# EAGLE design Wi-Fi_Button_v1 (EAGLE 8.7.1)

## Sheet 1 of 2
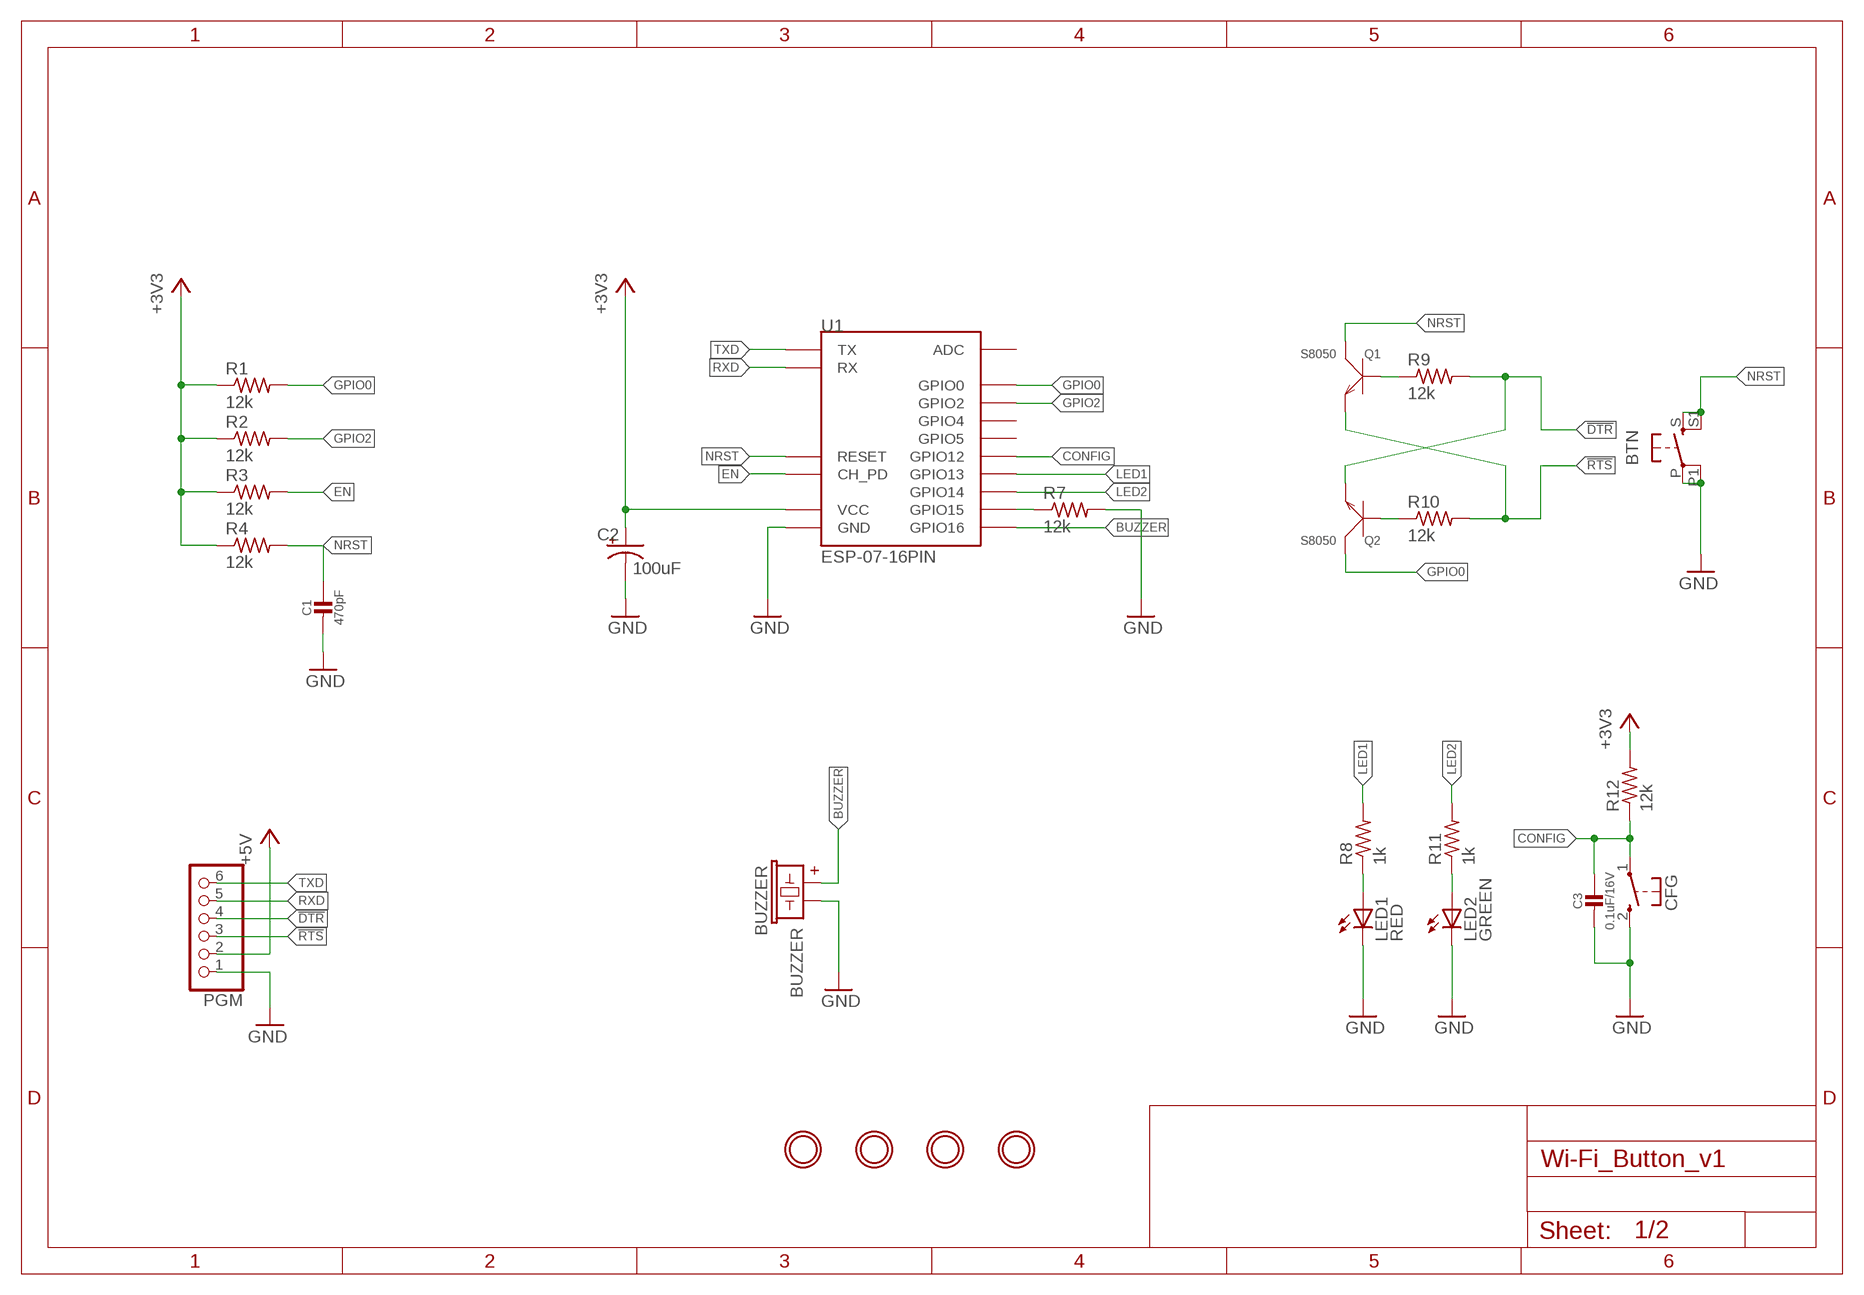
[diagram p0: schematic, sheet 1]

### Parts
$H1  MOUNTINGHOLE2.5  [MOUNTINGHOLE_2.5_PLATED]
$H2  MOUNTINGHOLE2.5  [MOUNTINGHOLE_2.5_PLATED]
$H3  MOUNTINGHOLE2.5  [MOUNTINGHOLE_2.5_PLATED]
$H4  MOUNTINGHOLE2.5  [MOUNTINGHOLE_2.5_PLATED]
BTN  SWITRONIC_12XXS  [SWITRONIC_12X12]
BUZZER  BUZZER  [BUUZER-HN9605B]
C1  470pF  CAP_CERAMIC_0805  [_0805]
C2  100uF  CPOL-USA/3216-18R  [A/3216-18R]
C3  0.1uF/16V  CAP_CERAMIC_0805  [_0805]
CFG  KSS-2EG4430  [KSS-2EG4430]
LED1  RED  LEDCHIP-LED0805  [CHIP-LED0805]
LED2  GREEN  LEDCHIP-LED0805  [CHIP-LED0805]
PGM  PINHD-1X6  [1X06]
Q1  S8050  SMD-TRANSISTORS-NPN-25V-500MW(SOT-23)  [SOT-23]
Q2  S8050  SMD-TRANSISTORS-NPN-25V-500MW(SOT-23)  [SOT-23]
R1  12k  R-US_M0805  [M0805]
R2  12k  R-US_M0805  [M0805]
R3  12k  R-US_M0805  [M0805]
R4  12k  R-US_M0805  [M0805]
R7  12k  R-US_M0805  [M0805]
R8  1k  R-US_M0805  [M0805]
R9  12k  R-US_M0805  [M0805]
R10  12k  R-US_M0805  [M0805]
R11  1k  R-US_M0805  [M0805]
R12  12k  R-US_M0805  [M0805]
U1  ESP-07-16PIN  [ESP-07-16PIN]

### Nets
!DTR: PGM.4 Q2.2(E) R9.2
!RTS: PGM.3 Q1.2(E) R10.2
+3V3: C2.+ R1.1 R2.1 R3.1 R4.1 R12.2 U1.VCC ; also sheet 2
+5V [usbvcc]: PGM.2 ; also sheet 2
BUZZER: BUZZER.1 U1.GPIO16
CONFIG: C3.1 CFG.1(P) R12.1 U1.GPIO12
EN: R3.2 U1.CH_PD
GND: BTN.P BTN.P1 BUZZER.2 C1.2 C2.- C3.2 CFG.2(S) LED1.C LED2.C PGM.1 R7.2 U1.GND ; also sheet 2
GPIO0: Q2.3(C) R1.2 U1.GPIO0
GPIO2: R2.2 U1.GPIO2
LED1: R8.2 U1.GPIO13
LED2: R11.2 U1.GPIO14
N$1: Q1.1(B) R9.1
N$2: Q2.1(B) R10.1
N$3: R7.1 U1.GPIO15
N$10: LED1.A R8.1
N$12: LED2.A R11.1
NRST: BTN.S BTN.S1 C1.1 Q1.3(C) R4.2 U1.REST(RESET)
RXD: PGM.5 U1.RX
TXD: PGM.6 U1.TX
Unconnected: U1.ADC U1.GPIO4 U1.GPIO5

## Sheet 2 of 2
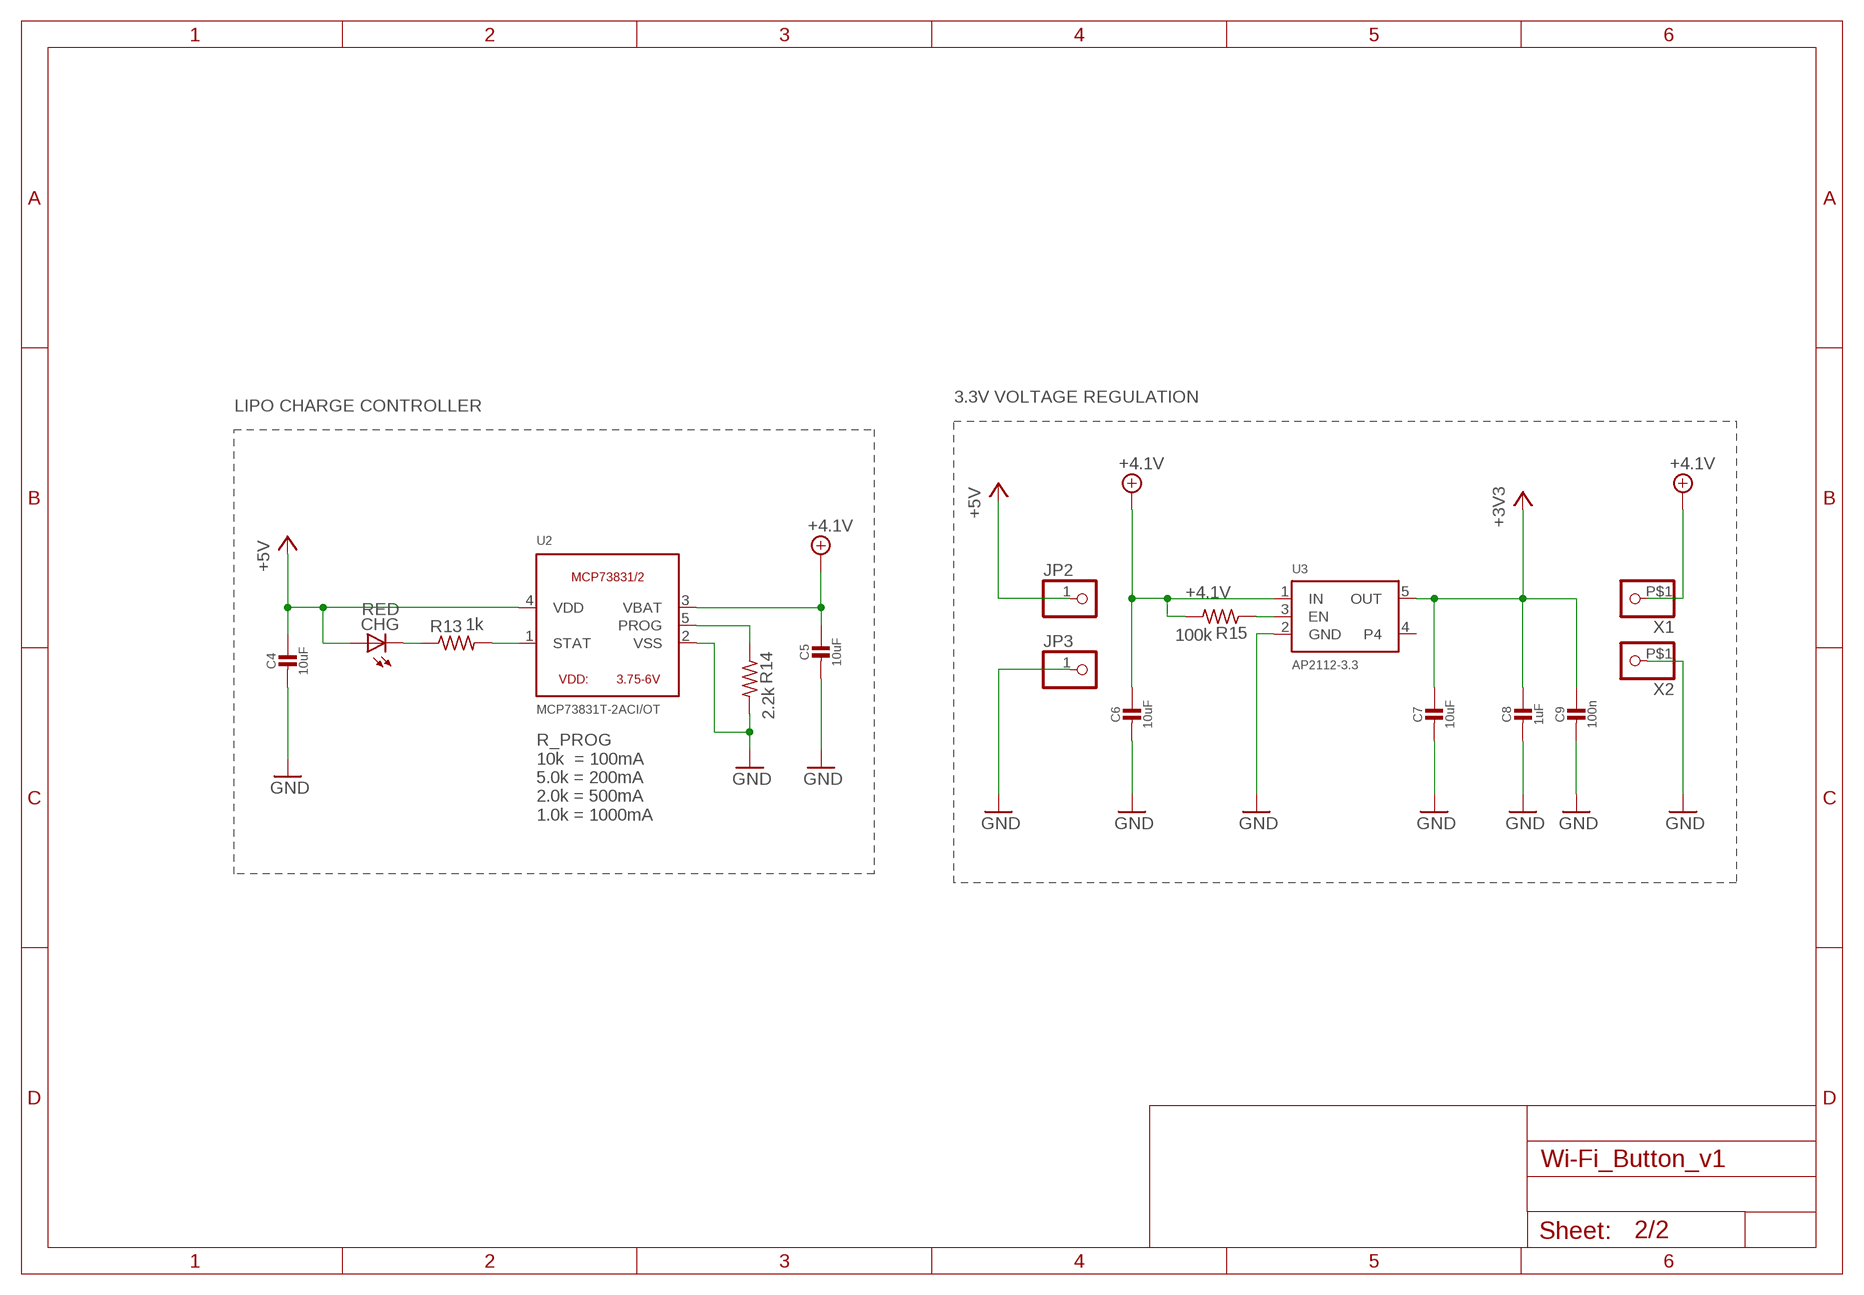
[diagram p1: schematic, sheet 2]

### Parts
C4  10uF  CAP_CERAMIC_0805  [_0805]
C5  10uF  CAP_CERAMIC_0805  [_0805]
C6  10uF  CAP_CERAMIC_0805  [_0805]
C7  10uF  CAP_CERAMIC_0805  [_0805]
C8  1uF  CAP_CERAMIC_0805  [_0805]
C9  100n  CAP_CERAMIC_0805  [_0805]
CHG  RED  LEDCHIP-LED0805  [CHIP-LED0805]
JP2  HEADER-1X1-SMD_MASKHELD_2X2MM  [1X01_SMD_MASKHELD_2X2MM]
JP3  HEADER-1X1-SMD_MASKHELD_2X2MM  [1X01_SMD_MASKHELD_2X2MM]
R13  1k  R-US_M0805  [M0805]
R14  2.2k  R-US_M0805  [M0805]
R15  100k  R-US_M0805  [M0805]
U2  MCP73831T-2ACI/OT  MCP73831/2  [SOT23-5]
U3  AP2112-3.3  VREG_SOT23-5  [SOT23-5]
X1  A23_PCB_MOUNT  [A23_PCB_MOUNT]
X2  A23_PCB_MOUNT  [A23_PCB_MOUNT]

### Nets
+3V3: C7.1 C8.1 C9.1 U3.5(OUT) ; also sheet 1
+4.1V: C5.1 C6.1 R15.2 U2.3(VBAT) U3.1(IN) X1.P$1
+5V [usbvcc]: C4.1 CHG.A JP2.1 U2.4(VDD) ; also sheet 1
GND: C4.2 C5.2 C6.2 C7.2 C8.2 C9.2 JP3.1 R14.2 U2.2(VSS) U3.2(GND) X2.P$1 ; also sheet 1
N$4: R15.1 U3.3(EN)
N$5: CHG.C R13.1
N$6: R13.2 U2.1(STAT)
N$9: R14.1 U2.5(PROG)
Unconnected: U3.4

### Notes on the sheet
- 3.3V VOLTAGE REGULATION
- LIPO CHARGE CONTROLLER
- R_PROG
  10k  = 100mA
  5.0k = 200mA
  2.0k = 500mA
  1.0k = 1000mA

## Library data of the parts
$H1-$H4 = Adafruit SIM808 Breakout:MOUNTINGHOLE: Mounting Hole For #2 screws (0.086"/2.18mm width, 0.094"/2.4mm hole) use 2.5mm; BOM: EXCLUDE
BTN = buttons:SWITRONIC_12XXS: SWITRONIC_12xxS Tact Switch Series <http://www.switronic.com.tw/Images/Cataloge/Cata_A09.gif> of Switronics <http://www.switronic.com.tw/>.
BUZZER = SparkFun-Electromechanical:BUZZER: Buzzer 12mm Spark Fun Electronics SKU : Comp-Buzzer
C1 C3-C9 = Adafruit111:CAP_CERAMIC: Ceramic Capacitors For new designs, use the packages preceded by an '_' character since they are more reliable: The following footprints should be used on most boards: _0402 - Standard footprint for regular board layouts _0603 - Standard footprint for regular board layouts _0805 - Standard footprint for regular board layouts _1206 - Standard footprint for regular board layouts For extremely tight-pitch boards where space is at a premium, the following 'micro-pitch' footprints can be used (smaller pads, no silkscreen outline, etc.): _0402MP - Micro-pitch footprint for very dense/compact boards _0603MP - Micro-pitch footprint for very dense/compact boards _0805MP - Micro-pitch footprint for very dense/compact boards _1206MP - Micro-pitch footprint for very dense/compact boards
C2 = rcl:CPOL-US: POLARIZED CAPACITOR, American symbol
CFG = buttons:KSS-2EG4430: Size: 3x6mm Height: 5mm from PCB Rating: DC12v 50mA Travel: 0.25±0.10mm Operating Force: 180±50gf Return Force: 60gf min Contact resistance: 100m? max Insulation resistance: 100M? min Operating life?50,000 cycles
CHG LED1 LED2 = led:LED: LED OSRAM: - CHIPLED LG R971, LG N971, LY N971, LG Q971, LY Q971, LO R971, LY R971 LH N974, LH R974 LS Q976, LO Q976, LY Q976 LO Q996 - Hyper CHIPLED LW Q18S LB Q993, LB Q99A, LB R99A - SideLED LS A670, LO A670, LY A670, LG A670, LP A670 LB A673, LV A673, LT A673, LW A673 LH A674 LY A675 LS A676, LA A676, LO A676, LY A676, LW A676 LS A679, LY A679, LG A679 - Hyper Micro SIDELED® LS Y876, LA Y876, LO Y876, LY Y876 LT Y87S - SmartLED LW L88C, LW L88S LB L89C, LB L89S, LG L890 LS L89K, LO L89K, LY L89K LS L896, LA L896, LO L896, LY L896 - TOPLED LS T670, LO T670, LY T670, LG T670, LP T670 LSG T670, LSP T670, LSY T670, LOP T670, LYG T670 LG T671, LOG T671, LSG T671 LB T673, LV T673, LT T673, LW T673 LH T674 LS T676, LA T676, LO T676, LY T676, LB T676, LH T676, LSB T676, LW T676 LB T67C, LV T67C, LT T67C, LS T67K, LO T67K, LY T67K, LW E67C LS E67B, LA E67B, LO E67B, LY E67B, LB E67C, LV E67C, LT E67C LW T67C LS T679, LY T679, LG T679 LS T770, LO T770, LY T770, LG T770, LP T770 LB T773, LV T773, LT T773, LW T773 LH T774 LS E675, LA E675, LY E675, LS T675 LS T776, LA T776, LO T776, LY T776, LB T776 LHGB T686 LT T68C, LB T68C - Hyper Mini TOPLED® LB M676 - Mini TOPLED Santana® LG M470 LS M47K, LO M47K, LY M47K Source: http://www.osram.convergy.de LUXEON: - LUMILED® LXK2-PW12-R00, LXK2-PW12-S00, LXK2-PW14-U00, LXK2-PW14-V00 LXK2-PM12-R00, LXK2-PM12-S00, LXK2-PM14-U00 LXK2-PE12-Q00, LXK2-PE12-R00, LXK2-PE12-S00, LXK2-PE14-T00, LXK2-PE14-U00 LXK2-PB12-K00, LXK2-PB12-L00, LXK2-PB12-M00, LXK2-PB14-N00, LXK2-PB14-P00, LXK2-PB14-Q00 LXK2-PR12-L00, LXK2-PR12-M00, LXK2-PR14-Q00, LXK2-PR14-R00 LXK2-PD12-Q00, LXK2-PD12-R00, LXK2-PD12-S00 LXK2-PH12-R00, LXK2-PH12-S00 LXK2-PL12-P00, LXK2-PL12-Q00, LXK2-PL12-R00 Source: www.luxeon.com KINGBRIGHT: KA-3528ASYC Source: www.kingbright.com
JP2 JP3 = Adafruit111:HEADER-1X1: PIN HEADER
PGM = adafruit:PINHD-1X6: PIN HEADER
Q1 Q2 = s8050-transistor:SMD-TRANSISTORS-NPN-25V-500MW(SOT-23): 305010017; AVAILABILITY: Unavailable; DESCRIPTION: SMD Transistors NPN 25V-500mW%3B; MF: JCET; MP: S8050; PACKAGE: SOT-23-3 JCET; PRICE: None
R1-R4 R7-R12 = rcl:R-US_: RESISTOR, American symbol
R13-R15 = resistor:R-US_: RESISTOR, American symbol
U1 = esp8266modules:ESP-07-16PIN: ESP8266 Wifi Module ESP-07 - 16 pins; DIMENSIONS: 22.0 x 16.0 mm; PINS: 16; PITCH: 0.078" / 2 mm
U2 = MCP73831:MCP73831/2: MCP73831/2 LIPO Charger VDD: 3.75 - 6V Temp -40 - 85°C Programmable Charge Rate: 15-500mA NOTE: STAT is a tri-state logic output on the MCP73831 and an open-drain output on the MCP73832. SOT23-5 with 4.2V output and tri-state logic on STAT = MCP73831T-2ACI/OT
U3 = AP2112 3.3 Reg:VREG_SOT23-5: SOT23-5 Fixed Voltage Regulators Part Current Out V Out V In V Dropout ?JA (°C/W) TJ (°C) Digikey Part No. ADP121 150mA 3.3V 3.4-5.5V 0.09V @ 150mA -- -- ADP121-AUJZ33R7CT-ND ADP121 150mA 3.0V 3.1-5.5V 0.09V @ 150mA -- -- ADP121-AUJZ30R7CT-ND ADP122 300mA 3.3V 3.4-5.5V 0.085V @ 300mA -- -- ADP122AUJZ-3.3-R7CT-ND ADP1712 300mA 3.3V 3.5-5.5V 0.17V @ 300mA -- -- ADP1712AUJZ-3.3-R7TR-ND AP7311 (Low Cost) 150mA 3.3V 3.5-6V 0.15V @ 150mA -- -- AP7311-33WG-7DICT-ND LD39015M18R 150mA 1.8V 1.9V-5.5V 0.08V @ 100mA -- -- 497-6977-1-ND LP2985A-33DBVR 150mA 3.3V 3.3-16V 0.28V @ 150mA 206 150 296-18479-1-ND MCP1824T-3302E/OT 300mA 3.3V 3.5V-6V 0.2V @ 300mA -- -- MCP1824T-3302E/OTCT-ND MIC5205-2.5YM5 TR 150mA 2.5V 2.7-16V 0.165V @ 150mA -- -- 576-1257-2-ND MIC5205-3.0YM5 TR 150mA 3.0V 3.2V-16V 0.165V @ 150mA -- -- 576-1258-2-ND MIC5205-3.3YM5 TR 150mA 3.3V 3.5V-16V 0.165V @ 150mA -- -- 576-1259-2-ND TPS780330220 150mA 3.3V+2.2V 3.6-5.5V 250mV Max -- -- 296-23332-1-ND TDA3663/N1,135 100mA 3.3V 3.5-45V 0.18V @ 50mA -- -- 568-5343-1-ND Max operating temp can be calculated using ?JA, TJ (max junction temperature), and power in watts. Set the "Maximum Ambient Temperature" until it reaches TJ ("Max Junction Temperature"), which is the absolute limit for safe use of the regulator: Heat Sink Temperature Calculator <http://www.daycounter.com/Calculators/Heat-Sink-Temperature-Calculator.phtml> For example, With 12V source into a 3.3V LP2985 and a 30mA load, we are dissipating (12V-3.3V) * 0.03A = 0.261W. With a ?JA of 206 °C/W, a TJ of 150°C, and 261mW we can safely use the chip without a heat sink up to 75°C (=147.1°C Junction Temperature).
X1 X2 = adafruit:A23_PCB_MOUNT

## Net classes
0 default: width 0.203 mm, drill 0.356 mm, clearance 0.203 mm
1 power: width 0.305 mm, drill 0.356 mm, clearance 0.203 mm
2 gnd: width 0.203 mm, drill 0.356 mm, clearance 0.152 mm
3 usbvcc: width 0.203 mm, drill 0.356 mm, clearance 0.152 mm

## Board
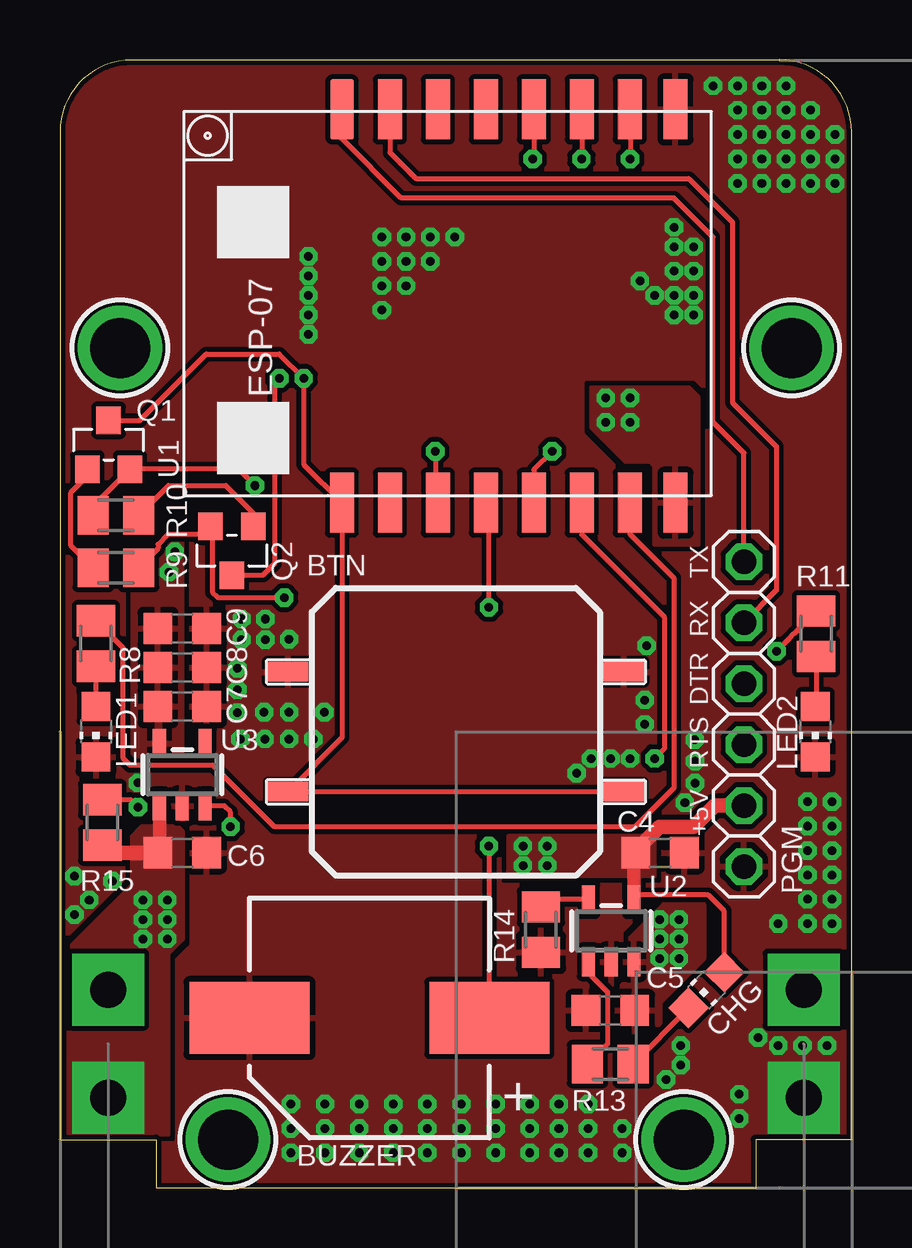
[diagram p2: board, top side]
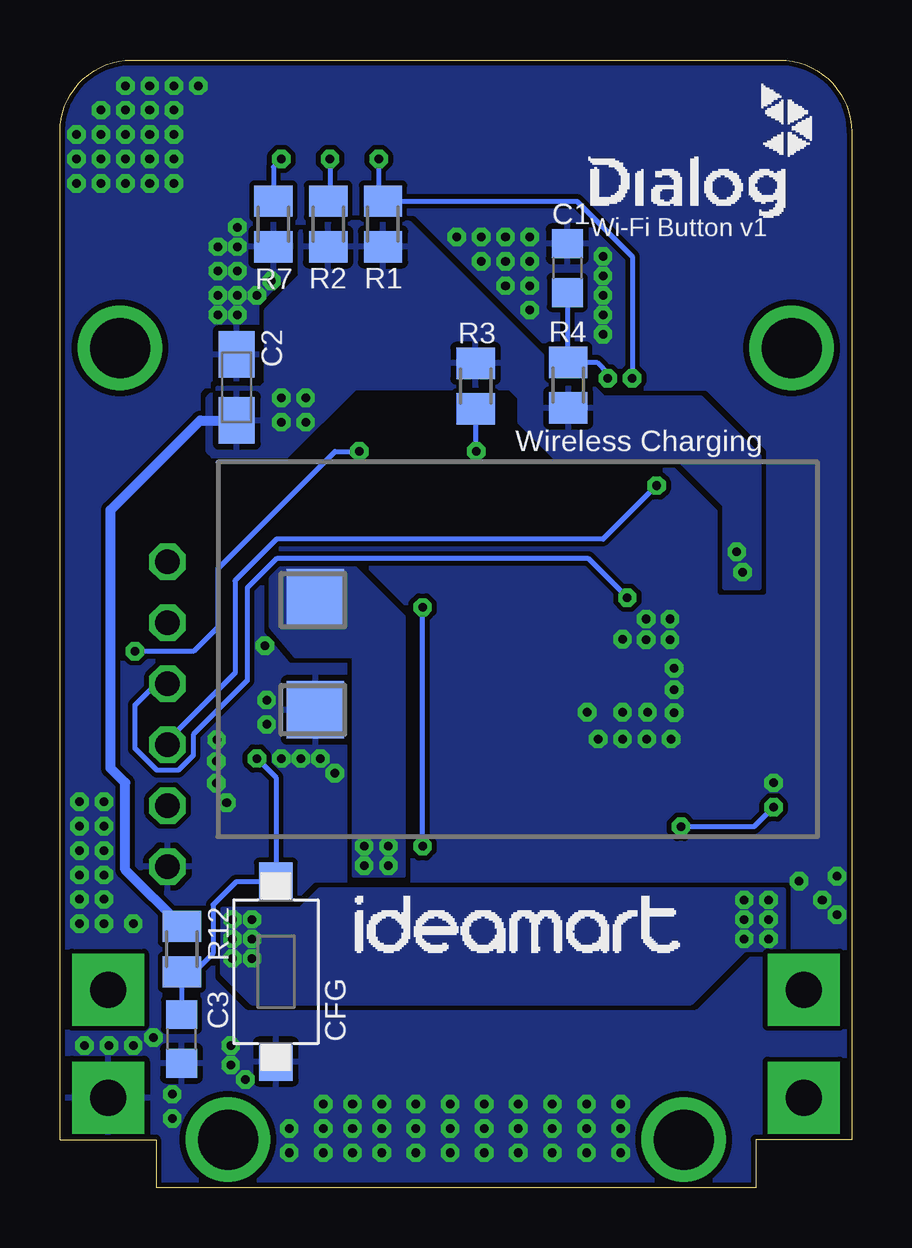
[diagram p3: board, bottom side, seen from below]

Size 33 x 47 mm. Coordinates in mm from the lower left corner, seen from the top.
Outline: 4,0 29,0 29,2 33,2 33,44 arc90 30,47 3,47 arc90 0,44 0,2 4,2 4,0
Copper layers (1*16): Top 0.035mm / dielectric 1.5mm / Bottom 0.035mm
Design rules "default *": minimum track width 8mil, minimum drill 14mil, track to track 6mil, track to pad 6mil, pad to pad 6mil, via to via 6mil, smd to smd 6mil, copper to edge 8mil, drill to drill 8mil, minimum pad ring 10mil, minimum via ring 8mil, stop-mask expansion 4mil, vias tented up to drill 14mil, thermal gap 10mil

### Footprints (pad centres in the part's own frame; a part is rotated, then mirrored left to right if it is on the bottom)
MOUNTINGHOLE_2.5_PLATED = drill 2.5 pad 3.2: P$1 0,0
SWITRONIC_12X12 = smd 1.676 x 0.813: P -7,2.5; P1 7,2.5; S -7,-2.5; S1 7,-2.5
BUUZER-HN9605B = smd 5 x 3: 1 -5,0.1; 2 5,0.1
_0805 = smd 1.2 x 1.3: 1 -1.016,0; 2 1.016,0
A/3216-18R = smd 1.95 x 1.5: + 1.375,0; - -1.375,0
KSS-2EG4430 = smd 1.6 x 1.4: 1 -3.75,0; 2 3.75,0
CHIP-LED0805 = smd 1.2 x 1.2: A 0,-1.05; C 0,1.05
1X01_SMD_MASKHELD_2X2MM = smd 2.4 x 2.4: 1 0,0
1X06 = drill 1.016 octagon: 1 -6.35,0; 2 -3.81,0; 3 -1.27,0; 4 1.27,0; 5 3.81,0; 6 6.35,0
SOT-23 = smd 1.016 x 1.143: 1 -0.889,-1.016; 2 0.889,-1.016; 3 0,1.016
M0805 = smd 1.3 x 1.6: 1 -0.95,0; 2 0.95,0
ESP-07-16PIN = smd 2.5 x 1: ADC -8.2,3.8; CH_PD -8.2,1.8; GND 8.2,-8.105; GPIO0 8.2,-2.2; GPIO2 8.2,-4.2; GPIO4 8.2,1.8; GPIO5 8.2,-0.2; GPIO12 -8.2,-4.2; GPIO13 -8.2,-6.2; GPIO14 -8.2,-2.2; GPIO15 8.2,-6.2; GPIO16 -8.2,-0.2; REST -8.2,5.8; RX 8.2,3.8; TX 8.2,5.8; VCC -8.2,-8.105
SOT23-5 = smd 0.55 x 1.2: 1 -0.95,-1.3; 2 0,-1.3; 3 0.95,-1.3; 4 0.95,1.3; 5 -0.95,1.3
A23_PCB_MOUNT = drill 1.5 pad 3 square: P$1 0,-2.25; P$2 0,2.25

### Placement (x,y rotation side)
$H1  2.5,35 0 top
$H2  30.5,35 0 top
$H3  7,2 0 top
$H4  26,2 0 top
BTN  16.5,19 0 top
BUZZER  12.9,7.17 180 top
C1  11.85,38.32 90 bottom
C2  25.63,33.35 270 bottom
C3  27.93,6.19 270 bottom
C4  25.01,13.96 0 top
C5  22.94,7.38 180 top
C6  5.1,13.96 0 top
C7  5.1,20.05 0 top
C8  5.1,21.68 0 top
C9  5.1,23.3 0 top
CFG  24,9 270 bottom
CHG  26.95,8.24 135 top
JP2  22.35,24.59 0 bottom
JP3  22.35,19.91 0 bottom
LED1  1.5,19 180 top
LED2  31.49,19 180 top
PGM  28.51,19.73 90 top
Q1  2.03,30.96 0 top
Q2  7.17,26.54 180 top
R1  19.53,40.16 90 bottom
R2  21.82,40.16 90 bottom
R3  15.67,33.4 270 bottom
R4  11.81,33.45 90 bottom
R7  24.1,40.16 270 bottom
R8  1.5,22.68 90 top
R9  2.33,25.83 0 top
R10  2.33,28.02 180 top
R11  31.52,23.08 90 top
R12  27.92,9.94 90 bottom
R13  22.94,5.15 180 top
R14  20.05,10.75 270 top
R15  1.76,15.22 270 top
U1  17.56,36.74 90 top
U2  22.98,10.7 0 top
U3  5.1,17.21 0 top
X1  2,6 0 top
X2  31,6 0 top

### Tracks (layer width: path | path; a pad name or v marks a point on that pad's centre or on a via)
!DTR  (via drill 0.36)
  Top 0.203: v9.35,24.59 6.6,24.59 6.35,24.83 6.35,27.48 Q2.2 5.93,27.21 4.49,27.21 4.09,26.81 4.09,26.64 R9.2
  Bottom 0.203: PGM.4 28.99,21 29.87,20.12 29.87,18.29 29.85,18.29 28.95,17.39 28.07,17.39 27.45,18.02 27.45,18.88 25.2,21.13 25.2,24.99 23.98,26.21 10.97,26.21 v9.35,24.59
!RTS  (via drill 0.36)
  Top 0.203: 2.92,29.75 Q1.2 | v8.13,29.26 7.44,29.95 Q1.2 | Q1.2 1.38,28.41 R10.2
  Bottom 0.203: PGM.3 28.51,18.63 25.7,21.44 25.7,25.3 23.98,27.03 10.36,27.03 v8.13,29.26
+3V3  (via drill 0.36)
  Bottom 0.406: R12.2 30.28,13.25 30.28,16.87 30.89,17.48 30.89,28.25 27.16,31.98 C2.+
  other vias: 4.78,26.5 4.55,25.65 22.76,32.92 23.77,32.92 23.77,31.9 22.76,31.9
  pour Top: 3.05,27.03 5.08,27.03 5.08,17.88 4.67,17.48 3.66,17.48 3.05,18.08
  pour Bottom: 5.28,24.99 5.28,28.45 7.11,30.28 12.19,30.28 13.82,31.9 13.82,32.92 14.22,33.32 20.73,33.32 23.57,30.48 26.62,30.48 26.82,30.68 26.82,32.92 26.42,33.32 24.59,33.32 24.38,33.53 24.38,36.58 22.96,38 22.96,39.83 22.56,40.23 18.49,40.23 12.8,34.54 12.8,33.73 12.4,33.32 10.77,33.32 10.36,32.92 6.3,32.92 3.86,30.48 3.86,24.99
  pour Top: 26.62,26.82 26.62,32.92 26.21,33.32 22.15,33.32 22.15,31.7 23.57,30.28 24.59,30.28 24.79,30.07 24.79,26.82
+4.1V  (via drill 0.36)
  Top 0.559: U3.1 4.15,14.02 C6.1
  Top 0.61: R15.2 2.08,13.96 C6.1
  other vias: 3.45,11.99 4.47,11.99 24.99,11.18 25.81,11.18 25.81,10.36 25.81,9.55 24.99,9.55 24.99,10.36 3.45,11.18 3.45,10.36 4.47,10.36 4.47,11.18
  pour Top: 23.16,6.71 23.16,8.13 23.57,8.53 23.57,10.16 25.2,11.79 26.82,11.79 26.82,9.55 24.99,7.72 24.99,7.11 24.99,6.91 24.99,6.71 24.79,6.5 23.37,6.5
  pour Top (no thermals): 0.41,2.24 0.41,9.96 1.42,10.97 3.05,12.6 3.05,14.63 3.45,15.04 4.88,15.04 5.08,14.83 5.08,10.36 4.47,9.75 4.47,2.24
  pour Bottom: 26.21,11.58 26.21,8.94 24.99,7.72 6.71,7.72 4.47,9.96 2.84,9.96 2.84,12.4 22.15,12.4 22.96,11.58
+5V  (via drill 0.36)
  Top 0.203: CHG.A 27.69,11.53 27.03,12.19 24.12,12.19 U2.4
  Top 0.559: U2.4 23.93,13.48 C4.1
  Top 0.61: PGM.2 27.3,15.92 26.42,15.04 24.99,15.04 24,14.04 C4.1
  other vias: 19.3,14.22 20.32,14.22 20.32,13.41 19.3,13.41
  pour Bottom (no thermals): 23.77,25.81 20.73,25.81 18.69,23.77 18.69,13 20.73,13 20.73,22.15 23.16,22.15 24.18,23.37 24.18,25.4
  pour Top (no thermals): 24.79,14.63 18.69,14.63 18.69,13 24.79,13
BUZZER  (via drill 0.36)
  Top 0.203: BUZZER.1 17.9,14.2 v17.88,14.22 | v17.88,24.18 17.88,28.42 U1.GPIO16
  Bottom 0.203: v17.88,14.22 v17.88,24.18
CONFIG  (via drill 0.36)
  Top 0.203: U1.GPIO12 21.76,27.21 25.2,23.77 25.2,18.29 v24.79,17.88
  Bottom 0.203: v24.79,17.88 24,17.09 CFG.1 25.66,12.75 26.62,11.79 26.62,9.75 27.43,8.94 27.91,8.94 | C3.1 27.91,7.6 27.91,8.94 | 27.91,8.94 R12.1
EN  (via drill 0.36)
  Top 0.203: v15.65,30.68 15.65,28.66 U1.CH_PD
  Bottom 0.203: R3.2 15.67,30.71 v15.65,30.68
GND  (via drill 0.36)
  other vias: 30.28,41.86 0.61,11.38 1.22,11.99 2.18,12.78 0.61,12.98 10.36,38.81 10.36,38 10.36,37.19 10.36,36.37 13.41,38.61 13.41,37.59 3.25,16.87 7.39,19.79 8.51,19.81 29.26,41.86 28.24,41.86 28.24,42.88 28.24,43.89 28.24,44.91 28.24,45.92 27.23,45.92 29.26,45.92 29.26,44.91 29.26,43.89 29.26,42.88 30.28,42.88 31.29,42.88 31.29,41.86 32.31,41.86 32.31,42.88 32.31,43.89 31.29,43.89 30.28,43.89 30.28,44.91 31.29,44.91 30.28,45.92 10.36,35.56 13.41,36.58 13.41,39.62 14.43,39.62 14.43,38.61 14.43,37.59 15.44,38.61 15.44,39.62 16.46,39.62 26.42,39.22 25.6,39.22 25.6,38.2 25.6,37.19 25.6,36.37 24.79,37.19 24.18,37.8 26.42,38.2 26.42,37.19 26.42,36.37 25.6,40.03 7.57,23.7 8.56,23.7 8.56,22.83 7.57,22.83 7.39,21.64 7.39,20.75 7.52,18.69 8.53,18.69 9.55,18.69 9.55,19.81 9.55,22.86 10.57,18.69 11.02,19.81 24.38,20.32 24.38,19.3 23.77,17.88 22.96,17.88 22.15,17.88 21.54,17.27 24.46,22.58 26.05,16.04 26.48,17.76 26.48,16.86 26.47,18.67 32.18,11 31.17,11 29.95,11 31.17,12.01 32.18,12.01 32.18,13.03 32.18,14.05 31.17,13.03 31.17,14.05 31.17,15.06 32.18,15.06 32.18,16.08 31.17,16.08 25.88,5.92 25.88,5.11 25.27,4.5 28.32,3.89 28.32,2.87 29.11,6.25 29.95,5.92 30.96,5.92 31.98,5.92 22.02,3.48 15.32,3.48 15.32,2.46 15.32,1.45 22.02,1.45 22.02,2.46 23.44,2.46 23.44,1.45 13.89,3.48 12.47,3.48 11.05,3.48 9.63,3.48 13.89,2.46 13.89,1.45 12.47,1.45 12.47,2.46 11.05,2.46 9.63,2.46 9.63,1.45 11.05,1.45 16.74,3.48 18.16,3.48 19.58,3.48 20.8,3.48 20.8,2.46 20.8,1.45 19.58,2.46 19.58,1.45 18.16,2.46 18.16,1.45 16.74,2.46 16.74,1.45
  pour Top (rank 6): -2.24,48.56 34.75,48.56 34.75,-2.24 -2.24,-2.24
  pour Bottom (rank 6): -2.24,48.56 34.75,48.56 34.75,-2.24 -2.24,-2.24
  pour Top (no thermals): 28.85,5.69 32.72,5.69 32.72,2.24 28.85,2.24
GPIO0  (via drill 0.36)
  Top 0.203: U1.GPIO0 19.76,43.13 19.71,43.08 v19.71,42.88 | Q2.3 8.46,25.53 8.94,26.01 8.94,33.53 v9.14,33.73
  Bottom 0.203: v19.71,42.88 19.71,41.29 R1.2 11.44,41.11 9.14,38.81 v9.14,33.73
GPIO2  (via drill 0.36)
  Top 0.203: U1.GPIO2 21.76,43.1 21.74,43.08 v21.74,42.88
  Bottom 0.203: v21.74,42.88 21.74,41.19 R2.2
LED1
  Top 0.203: R8.2 2.64,22.49 2.64,17.88 2.92,17.6 6.38,17.6 8.94,15.04 23.98,15.04 25.6,16.66 25.6,25.4 23.76,27.24 U1.GPIO13
LED2  (via drill 0.36)
  Top 0.203: R11.2 31.52,24 30.61,23.09 30.6,23.09 30.42,22.91 30.42,22.9 v29.87,22.35 | 19.76,27.79 U1.GPIO14 19.76,29.92 v20.52,30.68
  Bottom 0.203: v29.87,22.35 27.43,22.35 26.42,23.37 26.42,25.81 21.54,30.68 v20.52,30.68
N$1
  Top 0.203: Q1.1 1.14,29.65 0.43,28.94 0.43,26.79 R9.1
N$2
  Top 0.203: R10.1 4.53,29.26 6.91,29.26 8.05,28.11 Q2.1
N$3  (via drill 0.36)
  Top 0.203: U1.GPIO15 23.77,44.93 v23.77,42.88
  Bottom 0.203: v23.77,42.88 24.1,42.55 R7.1
N$4  (via drill 0.36)
  Top 0.203: R15.1 2.93,16.17 v3.25,15.85 | v7.11,15.04 7.11,15.65 6.85,15.91 U3.3
  Bottom 0.203: v3.25,15.85 4.06,15.04 v7.11,15.04
N$5
  Top 0.203: R13.1 26.21,7.46 CHG.C
N$6
  Top 0.203: U2.1 22.03,8.96 22.83,8.16 22.83,5.98 R13.2
N$9
  Top 0.203: U2.5 20.36,12 R14.1
N$10
  Top 0.203: R8.1 LED1.A
N$12
  Top 0.203: R11.1 31.52,20.08 LED2.A
NRST  (via drill 0.36)
  Top 0.203: BTN.S1 BTN.S 11.76,18.76 U1.REST 10.16,30.14 v10.16,33.73 9.14,34.75 6.1,34.75 3.33,31.98 Q1.3
  Bottom 0.203: C1.1 11.85,34.43 R4.2 10.62,34.4 10.16,33.93 v10.16,33.73
RXD
  Top 0.203: U1.RX 13.76,43.14 14.83,42.06 26.21,42.06 28.04,40.23 28.04,32.72 29.87,30.89 29.87,24.9 PGM.5
TXD
  Top 0.203: PGM.6 28.51,30.62 27.23,31.9 27.23,39.62 25.6,41.25 14.22,41.25 11.76,43.71 U1.TX

### Text on the board
tNames: TX | RX | DTR | RTS | +5V
bNames: Wi-Fi Button v1 | Wireless Charging